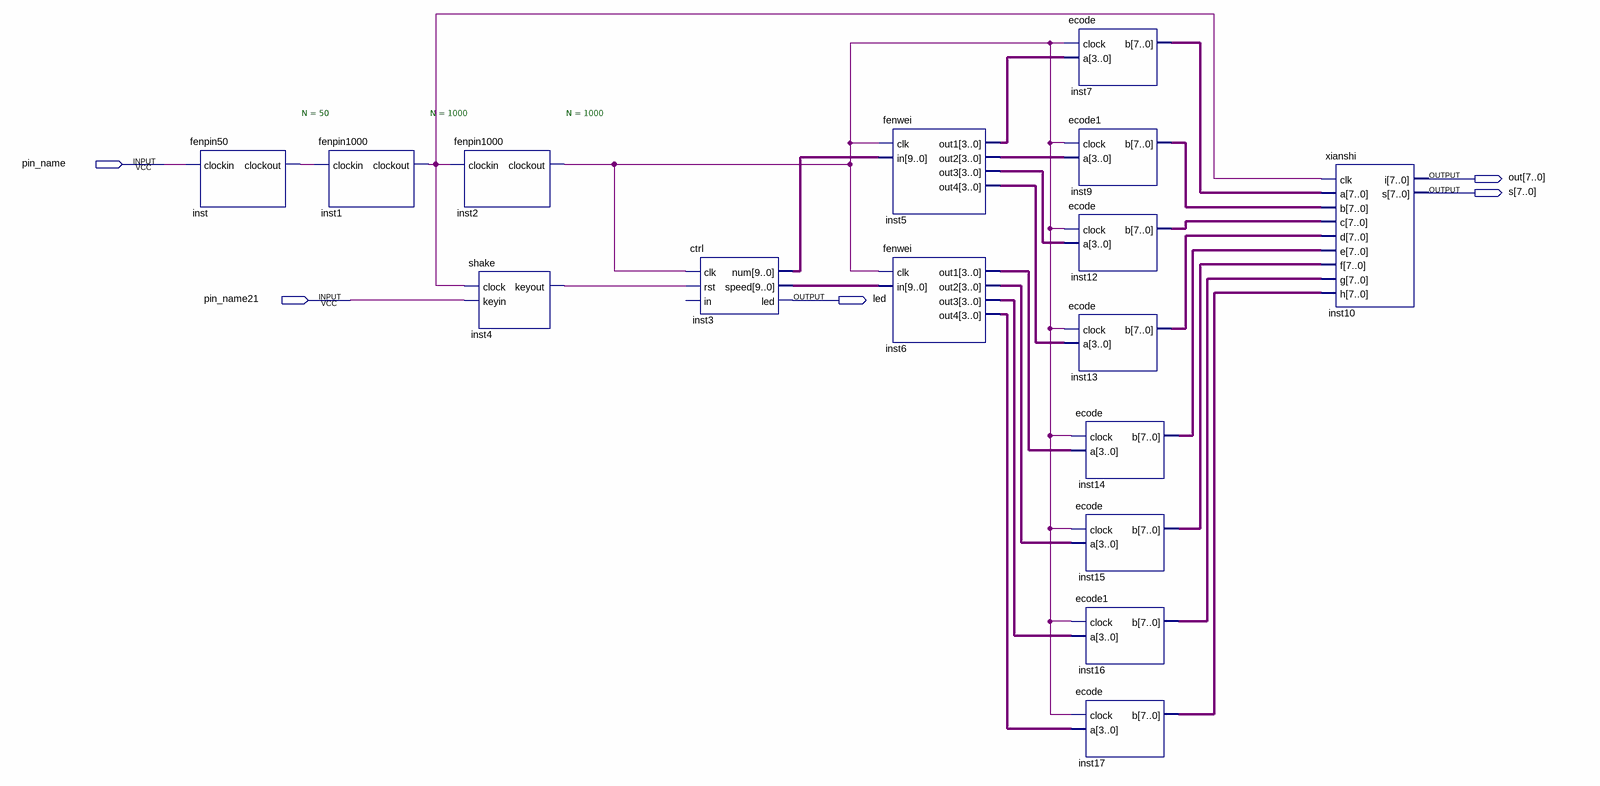
[diagram p0: schematic sheet]
// Quartus schematic bike.bdf as structural Verilog: 16 symbols, 5 pins
module bike (
  input  pin_name,
  input  pin_name21,
  output [7:0] out,
  output [7:0] s,
  output led
);

  wire inst1_clockout, inst2_clockout, inst4_keyout, inst_clockout;
  wire [3:0] inst5_out1, inst5_out2, inst5_out3, inst5_out4, inst6_out1, inst6_out2, inst6_out3, inst6_out4;
  wire [7:0] inst7_b, inst9_b, inst12_b, inst13_b, inst14_b, inst15_b, inst16_b, inst17_b;
  wire [9:0] inst3_num, inst3_speed;

  fenpin50 #(.N(50)) inst (.clockin(pin_name), .clockout(inst_clockout));
  fenpin1000 #(.N(1000)) inst1 (.clockin(inst_clockout), .clockout(inst1_clockout));
  fenpin1000 #(.N(1000)) inst2 (.clockin(inst1_clockout), .clockout(inst2_clockout));
  shake inst4 (.clock(inst1_clockout), .keyin(pin_name21), .keyout(inst4_keyout));
  ctrl inst3 (.clk(inst2_clockout), .rst(inst4_keyout), .num(inst3_num), .speed(inst3_speed), .led(led));  // open: in
  fenwei inst5 (
    .clk(inst2_clockout), .in(inst3_num), .out1(inst5_out1), .out2(inst5_out2), .out3(inst5_out3),
    .out4(inst5_out4));
  fenwei inst6 (
    .clk(inst2_clockout), .in(inst3_speed), .out1(inst6_out1), .out2(inst6_out2), .out3(inst6_out3),
    .out4(inst6_out4));
  ecode inst7 (.clock(inst2_clockout), .a(inst5_out1), .b(inst7_b));
  ecode1 inst9 (.clock(inst2_clockout), .a(inst5_out2), .b(inst9_b));
  ecode inst12 (.clock(inst2_clockout), .a(inst5_out3), .b(inst12_b));
  ecode inst13 (.clock(inst2_clockout), .a(inst5_out4), .b(inst13_b));
  ecode inst14 (.clock(inst2_clockout), .a(inst6_out1), .b(inst14_b));
  ecode inst15 (.clock(inst2_clockout), .a(inst6_out2), .b(inst15_b));
  ecode1 inst16 (.clock(inst2_clockout), .a(inst6_out3), .b(inst16_b));
  ecode inst17 (.clock(inst2_clockout), .a(inst6_out4), .b(inst17_b));
  xianshi inst10 (
    .clk(inst1_clockout), .a(inst7_b), .b(inst9_b), .c(inst12_b), .d(inst13_b), .e(inst14_b), .f(inst15_b),
    .g(inst16_b), .h(inst17_b), .i(out), .s(s));
endmodule
